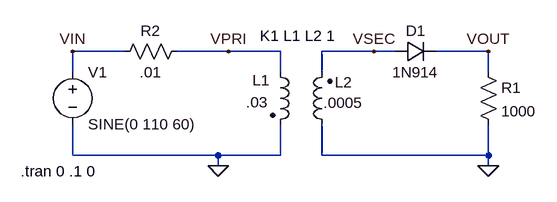
[diagram p0: schematic Transformer2.asc]
Transformer2.asc, the LTspice schematic file:
Version 4
SHEET 1 880 680
WIRE -32 48 -112 48
WIRE 128 48 48 48
WIRE 208 48 128 48
WIRE 352 48 272 48
WIRE 384 48 352 48
WIRE 528 48 448 48
WIRE -112 80 -112 48
WIRE 208 80 208 48
WIRE 272 80 272 48
WIRE 528 80 528 48
WIRE -112 208 -112 160
WIRE 112 208 -112 208
WIRE 208 208 208 160
WIRE 208 208 112 208
WIRE 272 208 272 160
WIRE 528 208 528 160
WIRE 528 208 272 208
WIRE 112 224 112 208
WIRE 528 224 528 208
FLAG 528 48 VOUT
FLAG -112 48 VIN
FLAG 528 224 0
FLAG 112 224 0
FLAG 352 48 VSEC
FLAG 128 48 VPRI
SYMBOL ind2 192 64 R0
WINDOW 0 -27 28 Left 0
WINDOW 3 -37 62 Left 0
SYMATTR InstName L1
SYMATTR Value .03
SYMATTR Type ind
SYMBOL voltage -112 64 R0
WINDOW 123 0 0 Left 0
WINDOW 39 0 0 Left 0
SYMATTR InstName V1
SYMATTR Value SINE(0 110 60)
SYMBOL res 512 64 R0
SYMATTR InstName R1
SYMATTR Value 1000
SYMBOL res 64 32 R90
WINDOW 0 0 56 VBottom 0
WINDOW 3 32 56 VTop 0
SYMATTR InstName R2
SYMATTR Value .01
SYMBOL ind2 288 176 R180
WINDOW 0 -31 81 Left 0
WINDOW 3 -47 49 Left 0
SYMATTR InstName L2
SYMATTR Value .0005
SYMATTR Type ind
SYMBOL diode 384 64 R270
WINDOW 0 32 32 VTop 0
WINDOW 3 0 32 VBottom 0
SYMATTR InstName D1
SYMATTR Value 1N914
TEXT -192 232 Left 0 !.tran 0 .1 0
TEXT 176 24 Left 0 !K1 L1 L2 1

The netlist it stands for:
* Transformer2.asc
L1 VPRI 0 .03
V1 VIN 0 SINE(0 110 60)
R1 VOUT 0 1000
R2 VPRI VIN .01
L2 0 VSEC .0005
D1 VSEC VOUT 1N914
.model D D
.lib standard.dio
.tran 0 .1 0
K1 L1 L2 1
.backanno
.end

* Results of the author's LTspice run, read from the files saved beside the schematic
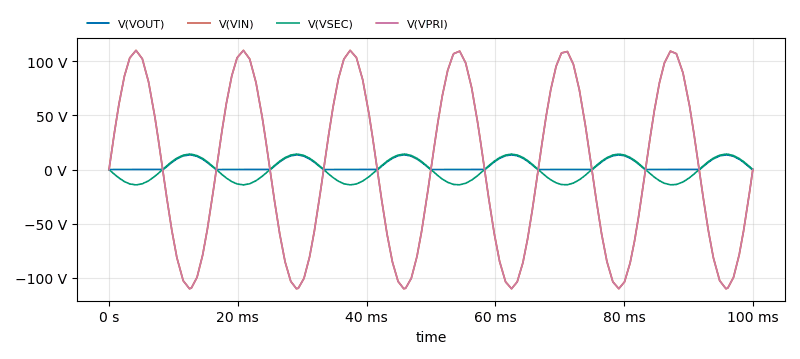
[diagram p1: Transient Analysis of Transformer2.asc, plotted from the saved traces]
* Transient Analysis, 1 run:
*   V(VOUT): min -28.55 µV, max 13.5 V, average 4.156 V, rms 6.647 V, last -28.55 µV
*   V(VIN): min -110 V, max 109.9 V, average -37.69 mV, rms 77.5 V, last 0 V
*   V(VSEC): min -14.18 V, max 14.21 V, average 17.21 mV, rms 10 V, last -411.6 µV
*   V(VPRI): min -110.1 V, max 109.8 V, average -133.3 mV, rms 77.5 V, last 3.188 mV